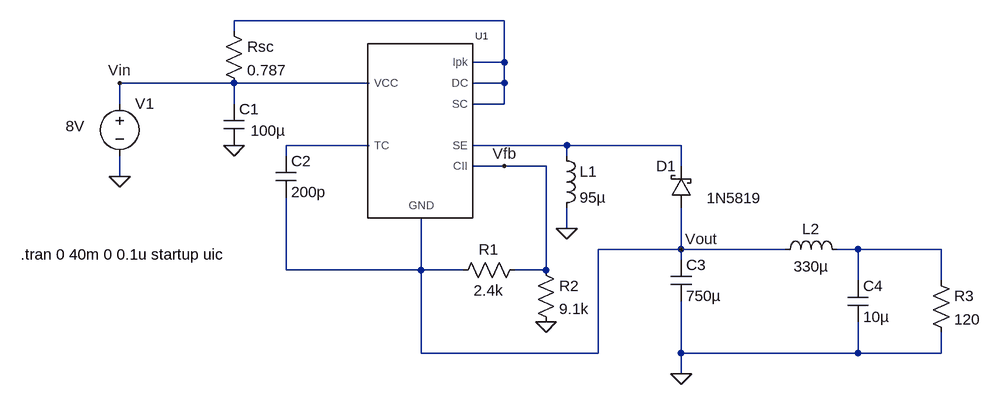
[diagram p0: schematic mc34063_buck_boost_inverting_testbench.asc]
mc34063_buck_boost_inverting_testbench.asc, the LTspice schematic file:
Version 4
SHEET 1 1044 772
WIRE 304 176 -112 176
WIRE -112 192 -112 176
WIRE 304 240 304 176
WIRE 304 240 256 240
WIRE -112 272 -288 272
WIRE 96 272 -112 272
WIRE 304 272 304 240
WIRE 304 272 256 272
WIRE -288 304 -288 272
WIRE -112 304 -112 272
WIRE 304 304 304 272
WIRE 304 304 256 304
WIRE 96 368 -32 368
WIRE 400 368 256 368
WIRE 576 368 400 368
WIRE -32 384 -32 368
WIRE 400 384 400 368
WIRE 304 400 256 400
WIRE 368 400 304 400
WIRE 576 400 576 368
WIRE -288 416 -288 384
WIRE 400 496 400 464
WIRE 576 528 576 464
WIRE 576 528 448 528
WIRE 736 528 576 528
WIRE 848 528 816 528
WIRE 976 528 848 528
WIRE 576 544 576 528
WIRE -32 560 -32 448
WIRE 176 560 176 480
WIRE 176 560 -32 560
WIRE 240 560 176 560
WIRE 368 560 368 400
WIRE 368 560 320 560
WIRE 848 576 848 528
WIRE 976 576 976 528
WIRE 176 688 176 560
WIRE 448 688 448 528
WIRE 448 688 176 688
WIRE 576 688 576 608
WIRE 848 688 848 640
WIRE 848 688 576 688
WIRE 976 688 976 656
WIRE 976 688 848 688
WIRE 576 720 576 688
FLAG -288 416 0
FLAG 400 496 0
FLAG 368 640 0
FLAG -112 368 0
FLAG 576 528 Vout
FLAG -288 272 Vin
FLAG 576 720 0
FLAG 304 400 Vfb
SYMBOL cap -128 304 R0
WINDOW 3 42 41 Left 2
SYMATTR Value 100µ
SYMATTR InstName C1
SYMBOL cap -48 384 R0
SYMATTR InstName C2
SYMATTR Value 200p
SYMBOL cap 560 544 R0
SYMATTR InstName C3
SYMATTR Value 750µ
SYMATTR SpiceLine Rser=0
SYMBOL ind 384 368 R0
SYMATTR InstName L1
SYMATTR Value 95µ
SYMATTR SpiceLine Rser=348m
SYMBOL schottky 592 464 R180
WINDOW 0 24 64 Left 2
WINDOW 3 -108 15 Left 2
SYMATTR InstName D1
SYMATTR Value 1N5819
SYMATTR Description Diode
SYMATTR Type diode
SYMBOL res 352 544 R0
SYMATTR InstName R2
SYMATTR Value 9.1k
SYMBOL res 336 544 R90
WINDOW 0 0 56 VBottom 2
WINDOW 3 32 56 VTop 2
SYMATTR InstName R1
SYMATTR Value 2.4k
SYMBOL res -128 176 R0
SYMATTR InstName Rsc
SYMATTR Value 0.787
SYMBOL voltage -288 288 R0
WINDOW 3 -83 50 Left 2
WINDOW 123 0 0 Left 0
WINDOW 39 0 0 Left 0
SYMATTR Value 8V
SYMATTR InstName V1
SYMBOL mc34063 208 304 R0
SYMATTR InstName U1
SYMBOL ind 720 544 R270
WINDOW 0 32 56 VTop 2
WINDOW 3 5 56 VBottom 2
SYMATTR InstName L2
SYMATTR Value 330µ
SYMATTR SpiceLine Rser=554m
SYMBOL cap 832 576 R0
SYMATTR InstName C4
SYMATTR Value 10µ
SYMATTR SpiceLine Rser=1.8
SYMBOL res 960 560 R0
SYMATTR InstName R3
SYMATTR Value 120
TEXT -440 536 Left 2 !.tran 0 40m 0 0.1u startup uic

The netlist it stands for:
* mc34063_buck_boost_inverting_testbench.asc
C1 Vin 0 100µ
C2 N002 Vout 200p
C3 Vout 0 750µ Rser=0
L1 N003 0 95µ Rser=348m
D1 Vout N003 1N5819
R2 Vfb 0 9.1k
R1 Vfb Vout 2.4k
Rsc N001 Vin 0.787
V1 Vin 0 8V
XU1 Vfb N001 Vout N001 N001 N003 N002 Vin mc34063  ; pins CII DC GND Ipk SC SE TC VCC
L2 Vout N004 330µ Rser=554m
C4 N004 0 10µ Rser=1.8
R3 N004 0 120
.model D D
.lib standard.dio
.tran 0 40m 0 0.1u startup uic
.lib mc34063.LIB
.backanno
.end